# EAGLE schematic VCOBoardTrimCap (EAGLE 9.2.1)
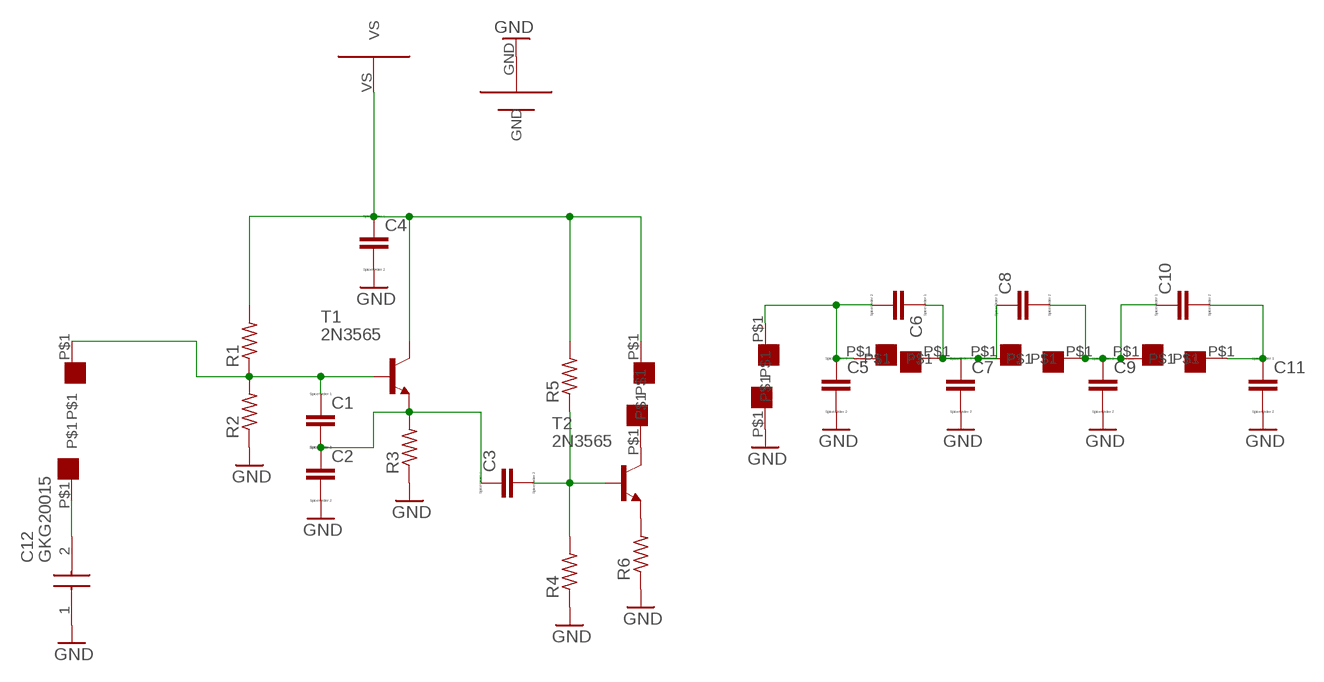
[diagram p0: schematic, sheet 1]

## Parts
C1  C  [C0805]
C2  C  [C0805]
C3  C  [C0805]
C4  C  [C0805]
C5  C  [C0805]
C6  C  [C0805]
C7  C  [C0805]
C8  C  [C0805]
C9  C  [C0805]
C10  C  [C0805]
C11  C  [C0805]
C12  GKG20015  [GKG20015]
R1  R-US_R0805  [R0805]
R2  R-US_R0805  [R0805]
R3  R-US_R0805  [R0805]
R4  R-US_R0805  [R0805]
R5  R-US_R0805  [R0805]
R6  R-US_R0805  [R0805]
T1  2N3565  [TO92]
T2  2N3565  [TO92]
U$1  PAD  [PAD]
U$2  PAD  [PAD]
U$3  PAD  [PAD]
U$4  PAD  [PAD]
U$5  ALLIGATORCLIPS  [ALLIGATORCONNECTOR]
U$6  PAD  [PAD]
U$7  PAD  [PAD]
U$8  PAD  [PAD]
U$9  PAD  [PAD]
U$10  PAD  [PAD]
U$11  PAD  [PAD]
U$12  PAD  [PAD]
U$13  PAD  [PAD]

## Nets
GND: C2.2 C4.2 C5.2 C7.2 C9.2 C11.2 C12.1 R2.1 R3.1 R4.1 R6.1 U$4.P$1 U$5.GND
N$1: R6.2 T2.3(E)
N$2: C4.1 R1.2 R5.2 T1.1(C) U$2.P$1 U$5.VS
N$3: C1.2 C2.1 C3.1 R3.2 T1.3(E)
N$4: C1.1 R1.1 R2.2 T1.2(B) U$7.P$1
N$5: C3.2 R4.2 R5.1 T2.2(B)
N$7: T2.1(C) U$1.P$1
N$8: C5.1 C6.2 U$3.P$1 U$8.P$1
N$10: C8.2 C9.1 C10.1 U$11.P$1 U$12.P$1
N$11: C10.2 C11.1 U$13.P$1
N$12: C12.2 U$6.P$1
N$13: C6.1 C7.1 C8.1 U$9.P$1 U$10.P$1

## Library data of the parts
C1-C11 = eagle-ltspice:C: CAPACITOR, European symbol; SPICEMODEL: NONE; SPICEPREFIX: C
C12 = SamacSys_Parts:GKG20015: Trimmer / Variable Capacitors 5-20pF 100V 85 DEG Source: Datasheet <http://www.mouser.com/datasheet/2/384/659305J-1204018.pdf>; DESCRIPTION: Trimmer / Variable Capacitors 5-20pF 100V 85 DEG; HEIGHT: 5.1mm; MANUFACTURER_NAME: Sprague Goodman; MANUFACTURER_PART_NUMBER: GKG20015; MOUSER_PART_NUMBER: 659-GKG20015; MOUSER_PRICE-STOCK: https://www.mouser.com/Search/Refine.aspx?Keyword=659-GKG20015
R1-R6 = resistor:R-US_: RESISTOR, American symbol
T1 T2 = transistor:2N3565: NPN TRANSISTOR
U$1-U$4 U$6-U$13 = Custom:PAD
U$5 = Custom:ALLIGATORCLIPS